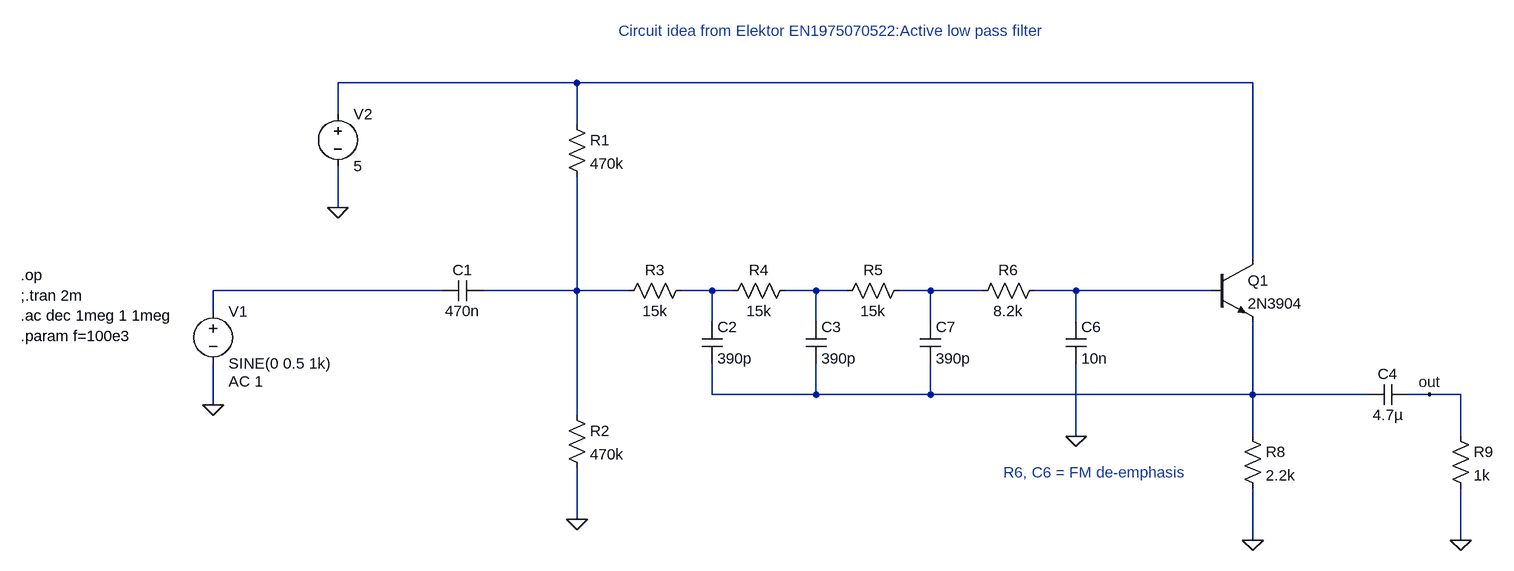
[diagram p0: schematic audio_filter.asc]
audio_filter.asc, the LTspice schematic file:
Version 4
SHEET 1 2636 740
WIRE -176 -48 -544 -48
WIRE 864 -48 -176 -48
WIRE -544 0 -544 -48
WIRE -176 16 -176 -48
WIRE -544 144 -544 80
WIRE 864 224 864 -48
WIRE -384 272 -736 272
WIRE -176 272 -176 96
WIRE -176 272 -320 272
WIRE -96 272 -176 272
WIRE 32 272 -16 272
WIRE 64 272 32 272
WIRE 192 272 144 272
WIRE 240 272 192 272
WIRE 368 272 320 272
WIRE 448 272 368 272
WIRE 592 272 528 272
WIRE 800 272 592 272
WIRE -736 304 -736 272
WIRE 32 320 32 272
WIRE 192 320 192 272
WIRE 368 320 368 272
WIRE 592 320 592 272
WIRE 32 432 32 384
WIRE 192 432 192 384
WIRE 192 432 32 432
WIRE 368 432 368 384
WIRE 368 432 192 432
WIRE 864 432 864 320
WIRE 864 432 368 432
WIRE 1040 432 864 432
WIRE 1136 432 1104 432
WIRE 1184 432 1136 432
WIRE -736 448 -736 384
WIRE -176 464 -176 272
WIRE 592 496 592 384
WIRE 864 496 864 432
WIRE 1184 496 1184 432
WIRE -176 624 -176 544
WIRE 864 656 864 576
WIRE 1184 656 1184 576
FLAG -544 144 0
FLAG -736 448 0
FLAG 864 656 0
FLAG -176 624 0
FLAG 592 496 0
FLAG 1136 432 out
FLAG 1184 656 0
DATAFLAG -272 272 ""
DATAFLAG 704 272 ""
DATAFLAG 752 432 ""
SYMBOL voltage -736 288 R0
WINDOW 123 24 124 Left 2
WINDOW 39 0 0 Left 0
SYMATTR Value2 AC 1
SYMATTR InstName V1
SYMATTR Value SINE(0 0.5 1k)
SYMBOL voltage -544 -16 R0
SYMATTR InstName V2
SYMATTR Value 5
SYMBOL npn 800 224 R0
SYMATTR InstName Q1
SYMATTR Value 2N3904
SYMBOL res 848 480 R0
SYMATTR InstName R8
SYMATTR Value 2.2k
SYMBOL cap -320 256 R90
WINDOW 0 0 32 VBottom 2
WINDOW 3 32 32 VTop 2
SYMATTR InstName C1
SYMATTR Value 470n
SYMBOL res -192 0 R0
SYMATTR InstName R1
SYMATTR Value 470k
SYMBOL res -192 448 R0
SYMATTR InstName R2
SYMATTR Value 470k
SYMBOL res 0 256 R90
WINDOW 0 0 56 VBottom 2
WINDOW 3 32 56 VTop 2
SYMATTR InstName R3
SYMATTR Value 15k
SYMBOL res 160 256 R90
WINDOW 0 0 56 VBottom 2
WINDOW 3 32 56 VTop 2
SYMATTR InstName R4
SYMATTR Value 15k
SYMBOL res 544 256 R90
WINDOW 0 0 56 VBottom 2
WINDOW 3 32 56 VTop 2
SYMATTR InstName R6
SYMATTR Value 8.2k
SYMBOL cap 16 320 R0
SYMATTR InstName C2
SYMATTR Value 390p
SYMBOL cap 176 320 R0
SYMATTR InstName C3
SYMATTR Value 390p
SYMBOL cap 576 320 R0
SYMATTR InstName C6
SYMATTR Value 10n
SYMBOL res 336 256 R90
WINDOW 0 0 56 VBottom 2
WINDOW 3 32 56 VTop 2
SYMATTR InstName R5
SYMATTR Value 15k
SYMBOL cap 352 320 R0
SYMATTR InstName C7
SYMATTR Value 390p
SYMBOL cap 1104 416 R90
WINDOW 0 0 32 VBottom 2
WINDOW 3 32 32 VTop 2
SYMATTR InstName C4
SYMATTR Value 4.7µ
SYMBOL res 1168 480 R0
SYMATTR InstName R9
SYMATTR Value 1k
TEXT -112 -128 Left 2 ;Circuit idea from Elektor EN1975070522:Active low pass filter
TEXT -1032 248 Left 2 !.op\n;.tran 2m\n.ac dec 1meg 1 1meg\n.param f=100e3
TEXT 480 552 Left 2 ;R6, C6 = FM de-emphasis

The netlist it stands for:
* audio_filter.asc
V1 N002 0 SINE(0 0.5 1k) AC 1
V2 N001 0 5
Q1 N001 N007 N008 0 2N3904
R8 N008 0 2.2k
C1 N003 N002 470n
R1 N001 N003 470k
R2 N003 0 470k
R3 N004 N003 15k
R4 N005 N004 15k
R6 N007 N006 8.2k
C2 N004 N008 390p
C3 N005 N008 390p
C6 N007 0 10n
R5 N006 N005 15k
C7 N006 N008 390p
C4 out N008 4.7µ
R9 out 0 1k
.model NPN NPN
.model PNP PNP
.lib standard.bjt
* Circuit idea from Elektor EN1975070522:Active low pass filter
.op
;.tran 2m
.ac dec 1meg 1 1meg
.param f=100e3
* R6, C6 = FM de-emphasis
.backanno
.end